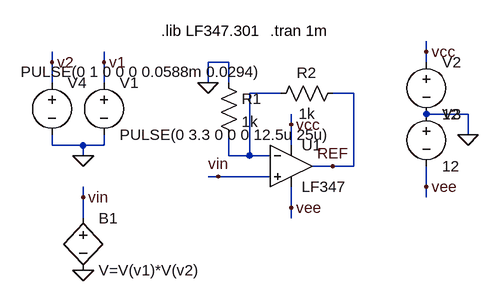
[diagram p0: schematic tx.asc]
tx.asc, the LTspice schematic file:
Version 4
SHEET 1 880 680
WIRE 624 112 624 96
WIRE 48 128 48 112
WIRE 128 128 128 112
WIRE 320 128 288 128
WIRE 624 128 624 112
WIRE 48 160 48 128
WIRE 128 160 128 128
WIRE 288 160 288 128
WIRE 320 160 320 128
WIRE 400 176 352 176
WIRE 512 176 480 176
WIRE 688 208 624 208
WIRE 416 224 416 208
WIRE 688 240 688 208
WIRE 48 256 48 240
WIRE 96 256 48 256
WIRE 128 256 128 240
WIRE 128 256 96 256
WIRE 416 256 416 224
WIRE 96 272 96 256
WIRE 320 272 320 240
WIRE 352 272 352 176
WIRE 352 272 320 272
WIRE 384 272 352 272
WIRE 480 288 448 288
WIRE 512 288 512 176
WIRE 512 288 480 288
WIRE 304 304 288 304
WIRE 384 304 304 304
WIRE 624 320 624 288
WIRE 96 336 96 320
WIRE 624 336 624 320
WIRE 416 352 416 320
WIRE 96 368 96 336
WIRE 416 368 416 352
FLAG 416 224 vcc
FLAG 416 352 vee
FLAG 304 304 vin
FLAG 288 160 0
FLAG 688 240 0
FLAG 624 112 vcc
FLAG 624 320 vee
FLAG 480 288 REF
FLAG 96 272 0
FLAG 96 448 0
FLAG 96 336 vin
FLAG 128 128 v1
FLAG 48 128 v2
SYMBOL OpAmps\\opamp2 416 224 R0
SYMATTR InstName U1
SYMATTR Value LF347
SYMBOL res 304 144 R0
SYMATTR InstName R1
SYMATTR Value 1k
SYMBOL res 496 160 R90
WINDOW 0 0 56 VBottom 2
WINDOW 3 32 56 VTop 2
SYMATTR InstName R2
SYMATTR Value 1k
SYMBOL voltage 624 112 R0
WINDOW 123 0 0 Left 0
WINDOW 39 0 0 Left 0
SYMATTR InstName V2
SYMATTR Value 12
SYMBOL voltage 624 192 R0
WINDOW 123 0 0 Left 0
WINDOW 39 0 0 Left 0
SYMATTR InstName V3
SYMATTR Value 12
SYMBOL voltage 128 144 R0
WINDOW 123 0 0 Left 0
WINDOW 39 0 0 Left 0
SYMATTR InstName V1
SYMATTR Value PULSE(0 3.3 0 0 0 12.5u 25u)
SYMBOL voltage 48 144 R0
WINDOW 3 -48 -1 Left 2
WINDOW 123 0 0 Left 0
WINDOW 39 0 0 Left 0
SYMATTR InstName V4
SYMATTR Value PULSE(0 1 0 0 0 0.0588m 0.0294)
SYMBOL bv 96 352 R0
SYMATTR InstName B1
SYMATTR Value V=V(v1)*V(v2)
TEXT 216 80 Left 2 !.lib LF347.301
TEXT 384 80 Left 2 !.tran 1m

The netlist it stands for:
* tx.asc
XU1 vin N001 vcc vee REF LF347  ; pins In+ In- V+ V- OUT
R1 0 N001 1k
R2 REF N001 1k
V2 vcc 0 12
V3 0 vee 12
V1 v1 0 PULSE(0 3.3 0 0 0 12.5u 25u)
V4 v2 0 PULSE(0 1 0 0 0 0.0588m 0.0294)
B1 vin 0 V=V(v1)*V(v2)
.lib LF347.301
.tran 1m
.backanno
.end